# EAGLE schematic assignment (EAGLE 9.6.2)
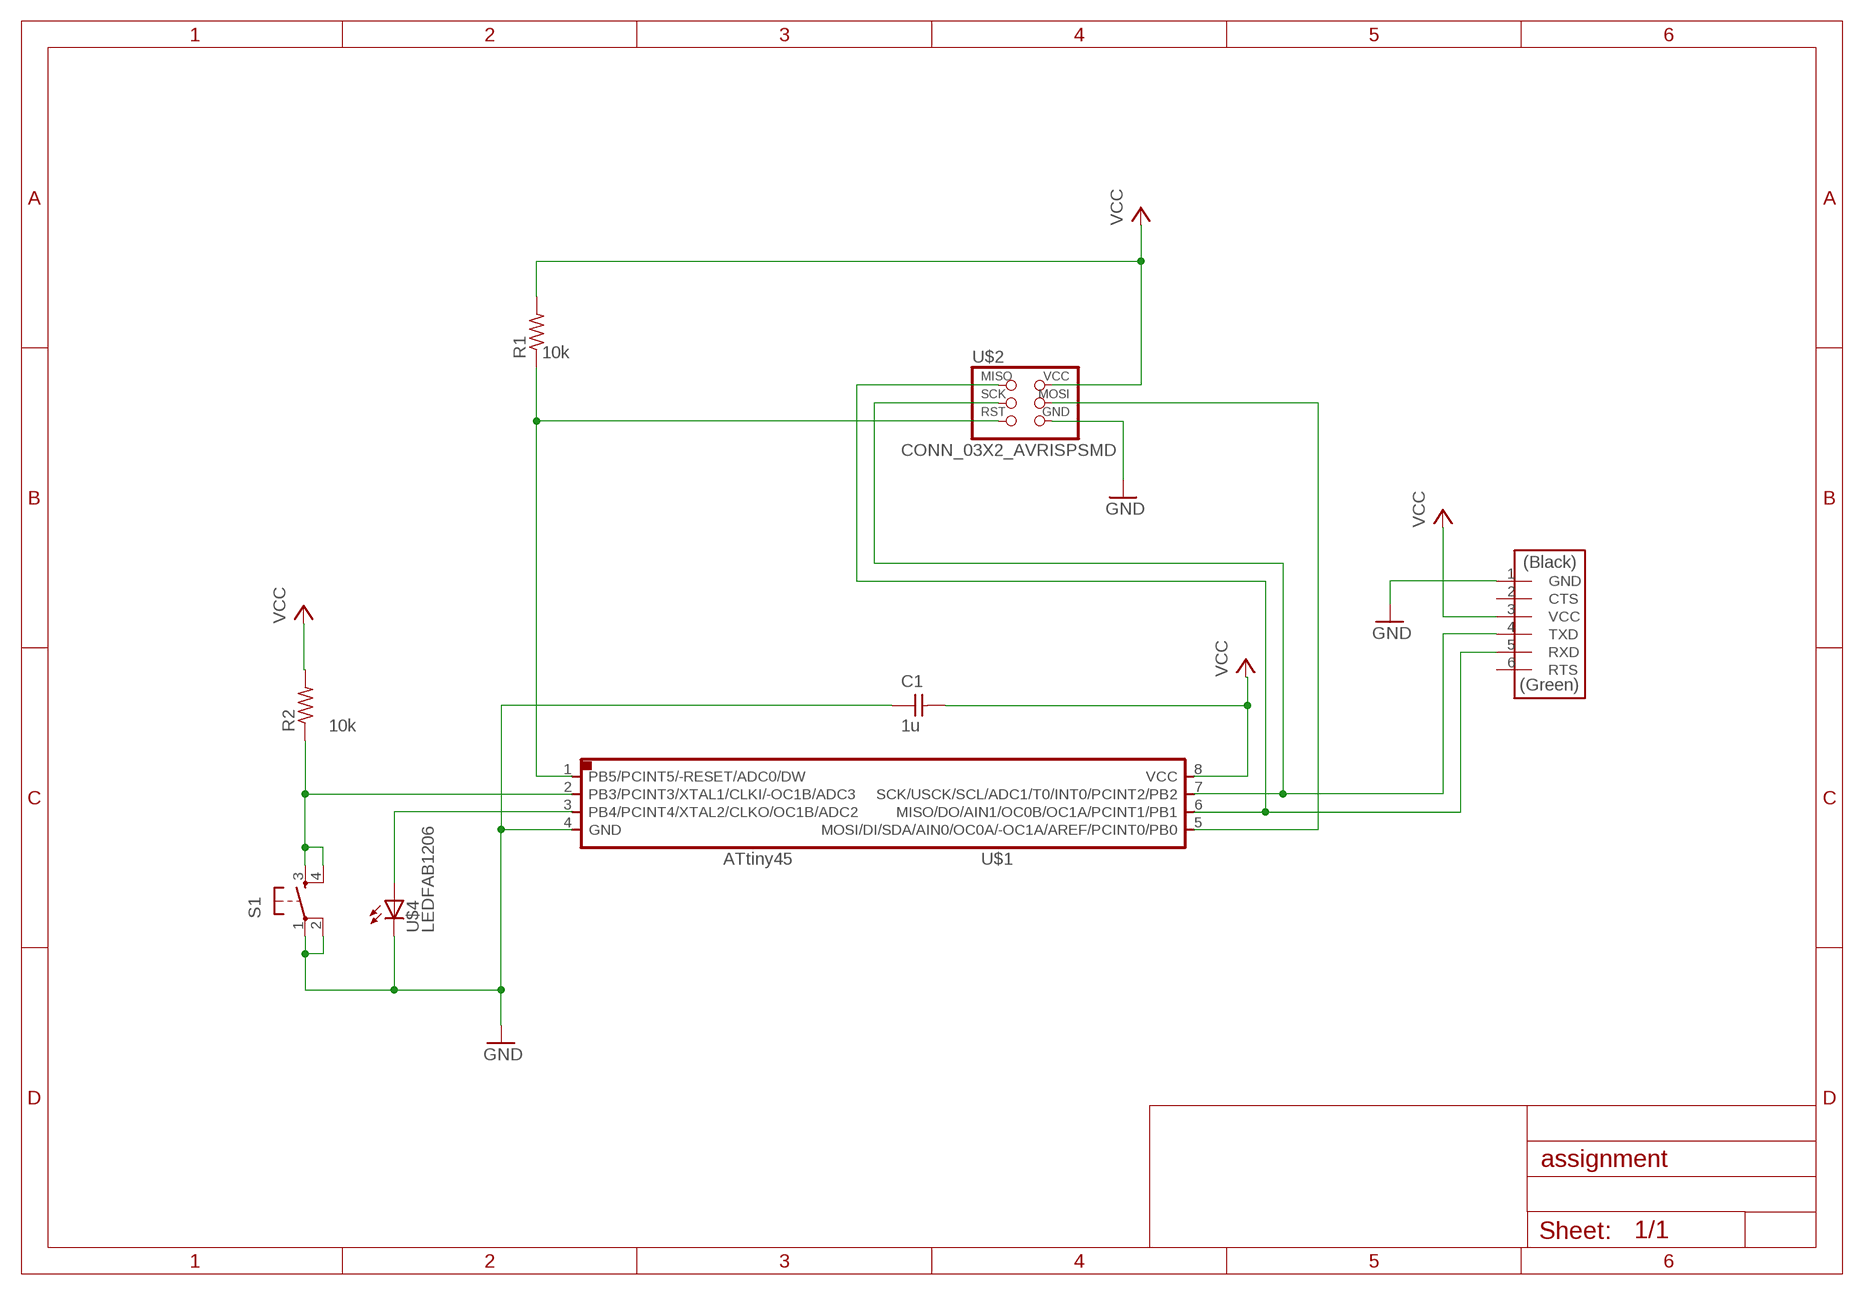
[diagram p0: schematic, sheet 1]

## Parts
C1  1u  CAP_UNPOLARIZEDFAB  [C1206FAB]
R1  10k  R1206FAB  [R1206FAB]
R2  10k  R1206FAB  [R1206FAB]
S1  SW_SWITCH_TACTILE_6MM6MM_SWITCH  [6MM_SWITCH]
U$1  UC_ATTINY45SI  [SOIC8]
U$2  CONN_03X2_AVRISPSMD  [2X03SMD]
U$3  CONN_06_FTDI-SMD-HEADER  [1X06SMD]
U$4  LEDFAB1206  [LED1206FAB]

## Nets
GND: C1.1 S1.1(P) S1.2(P1) U$1.4(GND) U$2.6(GND) U$3.1(GND) U$4.2(C)
N$1: U$1.5(MOSI/DI/SDA/AIN0/OC0A/-OC1A/AREF/PCINT0/PB0) U$2.4(MOSI)
N$2: U$1.7(SCK/USCK/SCL/ADC1/T0/INT0/PCINT2/PB2) U$2.3(SCK) U$3.4(TXD)
N$3: U$1.6(MISO/DO/AIN1/OC0B/OC1A/PCINT1/PB1) U$2.1(MISO) U$3.5(RXD)
N$4: R1.1 U$1.1(PB5/PCINT5/-RESET/ADC0/DW) U$2.5(RST)
N$5: R2.1 S1.3(S) S1.4(S1) U$1.2(PB3/PCINT3/XTAL1/CLKI/-OC1B/ADC3)
N$6: U$1.3(PB4/PCINT4/XTAL2/CLKO/OC1B/ADC2) U$4.1(A)
VCC: C1.2 R1.2 R2.2 U$1.8(VCC) U$2.2(VCC) U$3.3(VCC)
Unconnected: U$3.2(CTS) U$3.6(RTS)

## Library data of the parts
C1 = eagle_fab:CAP_UNPOLARIZED
R1 R2 = eagle_fab:R: Resistor (US Symbol) Variants with postfix FAB are widened to allow the routing of internal traces
S1 = eagle_fab:SW_SWITCH_TACTILE_6MM: OMRON SWITCH
U$1 = eagle_fab:UC_ATTINY45
U$2 = eagle_fab:CONN_03X2_AVRISP
U$3 = eagle_fab:CONN_06_FTDI-SMD-HEADER
U$4 = eagle_fab:LED: LED